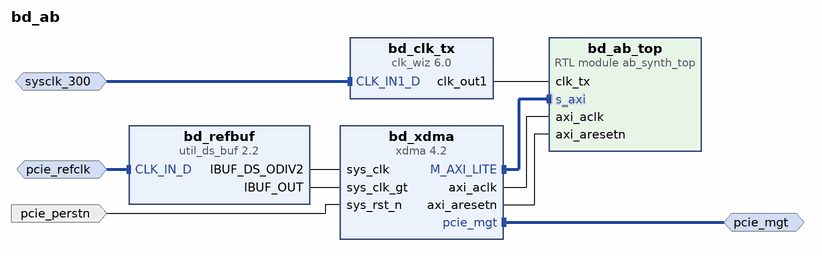
[diagram p0: block diagram of the top level]
# Vivado block design bd_ab, xcku5p-ffvb676-2-e, Vivado 2025.1
create_bd_design bd_ab

create_bd_intf_port -mode Slave -vlnv xilinx.com:interface:diff_clock_rtl:1.0 pcie_refclk
create_bd_intf_port -mode Master -vlnv xilinx.com:interface:pcie_7x_mgt_rtl:1.0 pcie_mgt
create_bd_intf_port -mode Slave -vlnv xilinx.com:interface:diff_clock_rtl:1.0 sysclk_300
set_property -dict {CONFIG.FREQ_HZ 300000000} [get_bd_intf_ports sysclk_300]
create_bd_port -dir I -type rst pcie_perstn
set_property -dict {CONFIG.POLARITY ACTIVE_LOW} [get_bd_ports pcie_perstn]

create_bd_cell -type ip -vlnv xilinx.com:ip:xdma:4.2 bd_xdma
set_property -dict [list \
  CONFIG.axilite_master_en true \
  CONFIG.axilite_master_scale Kilobytes \
  CONFIG.axilite_master_size 64 \
  CONFIG.mode_selection Basic \
  CONFIG.pl_link_cap_max_link_speed 8.0_GT/s \
  CONFIG.pl_link_cap_max_link_width X8 \
] [get_bd_cells bd_xdma]
create_bd_cell -type ip -vlnv xilinx.com:ip:clk_wiz:6.0 bd_clk_tx
set_property -dict [list \
  CONFIG.CLKOUT1_REQUESTED_OUT_FREQ 312.500 \
  CONFIG.PRIM_IN_FREQ 300.000 \
  CONFIG.PRIM_SOURCE Differential_clock_capable_pin \
  CONFIG.USE_RESET false \
] [get_bd_cells bd_clk_tx]
create_bd_cell -type module -reference ab_synth_top bd_ab_top
create_bd_cell -type ip -vlnv xilinx.com:ip:util_ds_buf:2.2 bd_refbuf
set_property -dict {CONFIG.C_BUF_TYPE IBUFDSGTE} [get_bd_cells bd_refbuf]

# ---- connections ----

connect_bd_intf_net [get_bd_intf_pins bd_xdma/M_AXI_LITE] [get_bd_intf_pins bd_ab_top/s_axi]
connect_bd_intf_net [get_bd_intf_ports pcie_mgt] [get_bd_intf_pins bd_xdma/pcie_mgt]
connect_bd_intf_net [get_bd_intf_ports pcie_refclk] [get_bd_intf_pins bd_refbuf/CLK_IN_D]
connect_bd_intf_net -intf_net sysclk_300_1 [get_bd_intf_ports sysclk_300] [get_bd_intf_pins bd_clk_tx/CLK_IN1_D]
connect_bd_net [get_bd_pins bd_clk_tx/clk_out1] [get_bd_pins bd_ab_top/clk_tx]
connect_bd_net [get_bd_pins bd_refbuf/IBUF_DS_ODIV2] [get_bd_pins bd_xdma/sys_clk]
connect_bd_net [get_bd_pins bd_refbuf/IBUF_OUT] [get_bd_pins bd_xdma/sys_clk_gt]
connect_bd_net [get_bd_pins bd_xdma/axi_aclk] [get_bd_pins bd_ab_top/axi_aclk]
connect_bd_net [get_bd_pins bd_xdma/axi_aresetn] [get_bd_pins bd_ab_top/axi_aresetn]
connect_bd_net [get_bd_ports pcie_perstn] [get_bd_pins bd_xdma/sys_rst_n]

# ---- address map ----
assign_bd_address -offset 0x00000000 -range 4G -target_address_space [get_bd_addr_spaces bd_xdma/M_AXI_LITE] [get_bd_addr_segs bd_ab_top/s_axi/reg0]

validate_bd_design
save_bd_design
